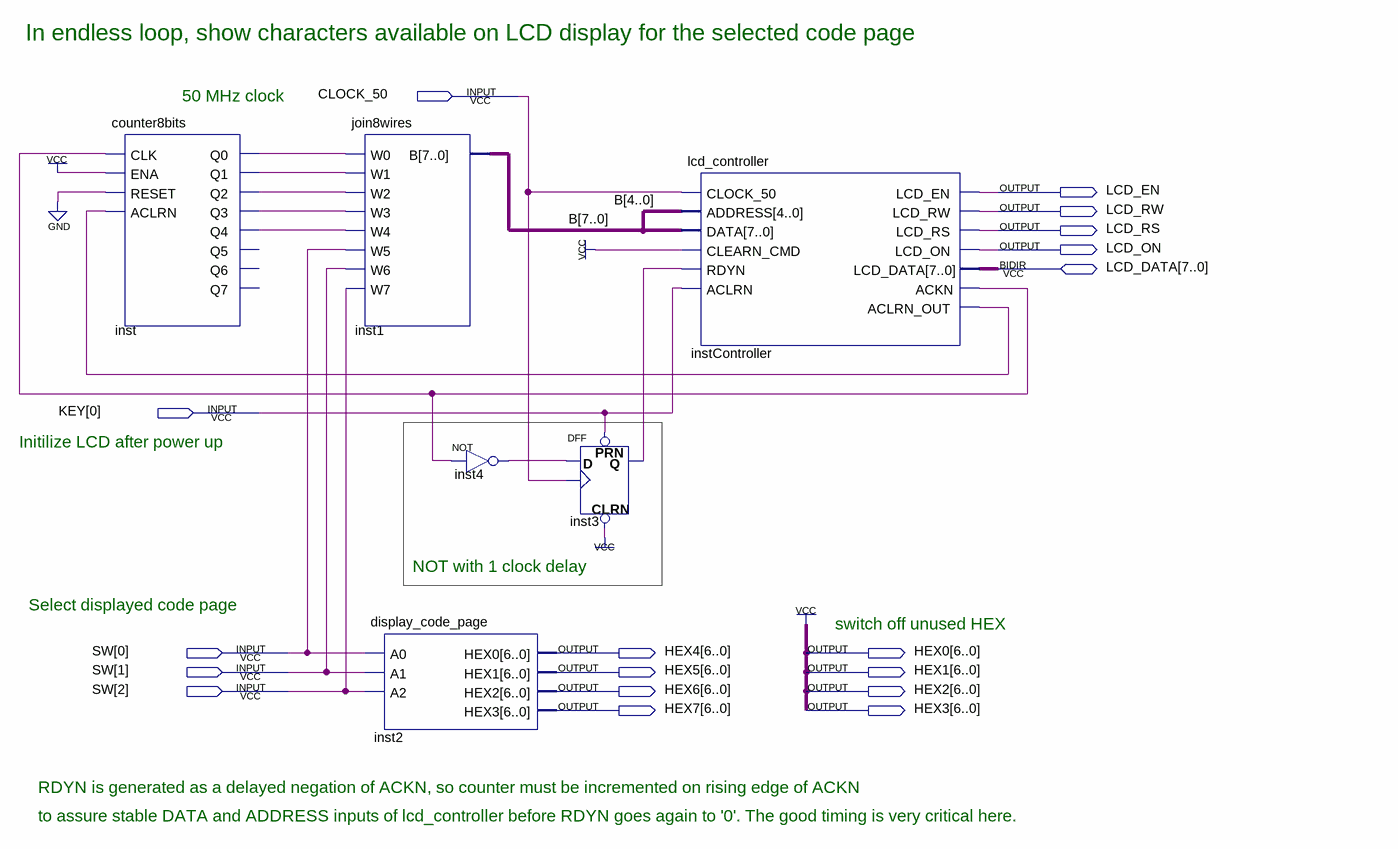
[diagram p0: schematic sheet]
// Quartus schematic lcd_demo_code_pages_schema.bdf as structural Verilog: 6 symbols, 18 pins
module lcd_demo_code_pages_schema (
  input  CLOCK_50,
  input  [0:0] KEY,
  input  [2:0] SW,
  inout  [7:0] LCD_DATA,
  output LCD_EN,
  output LCD_RW,
  output LCD_RS,
  output LCD_ON,
  output [6:0] HEX4,
  output [6:0] HEX0,
  output [6:0] HEX5,
  output [6:0] HEX1,
  output [6:0] HEX6,
  output [6:0] HEX2,
  output [6:0] HEX7,
  output [6:0] HEX3
);

  wire inst3_q, inst4_out, inst_q0, inst_q1, inst_q2, inst_q3, inst_q4, instController_ackn,
       instController_aclrn_out;
  wire [7:0] B;

  counter8bits inst (
    .CLK(instController_ackn), .ENA(1'b1), .RESET(1'b0), .ACLRN(instController_aclrn_out), .Q0(inst_q0),
    .Q1(inst_q1), .Q2(inst_q2), .Q3(inst_q3), .Q4(inst_q4));  // open: Q5, Q6, Q7
  join8wires inst1 (
    .W0(inst_q0), .W1(inst_q1), .W2(inst_q2), .W3(inst_q3), .W4(inst_q4), .W5(SW[0]), .W6(SW[1]), .W7(SW[2]),
    .B(B));
  display_code_page inst2 (.A0(SW[0]), .A1(SW[1]), .A2(SW[2]), .HEX0(HEX4), .HEX1(HEX5), .HEX2(HEX6), .HEX3(HEX7));
  not inst4 (inst4_out, instController_ackn);
  DFF inst3 (.CLRN(1'b1), .CLK(CLOCK_50), .D(inst4_out), .PRN(KEY[0]), .Q(inst3_q));
  lcd_controller instController (
    .CLOCK_50(CLOCK_50), .ADDRESS(B[4:0]), .DATA(B), .CLEARN_CMD(1'b1), .RDYN(inst3_q), .ACLRN(KEY[0]),
    .LCD_EN(LCD_EN), .LCD_RW(LCD_RW), .LCD_RS(LCD_RS), .LCD_ON(LCD_ON), .ACKN(instController_ackn),
    .ACLRN_OUT(instController_aclrn_out), .LCD_DATA(LCD_DATA));

  assign HEX0 = {7{1'b1}};
  assign HEX1 = {7{1'b1}};
  assign HEX2 = {7{1'b1}};
  assign HEX3 = {7{1'b1}};

  // Notes on the sheet:
  //    In endless loop, show characters available on LCD display for the selected code page
  //   50 MHz clock
  //   Initilize LCD after power up
  //   NOT with 1 clock delay
  //   Select displayed code page
  //   switch off unused HEX
  //   RDYN is generated as a delayed negation of ACKN, so counter must be incremented on rising edge of ACKN
  //   to assure stable DATA and ADDRESS inputs of lcd_controller before RDYN goes again to '0'. The good timing is very critical here.
endmodule
